# EAGLE design stm8-accelerometer -1 (EAGLE 6.5.0)
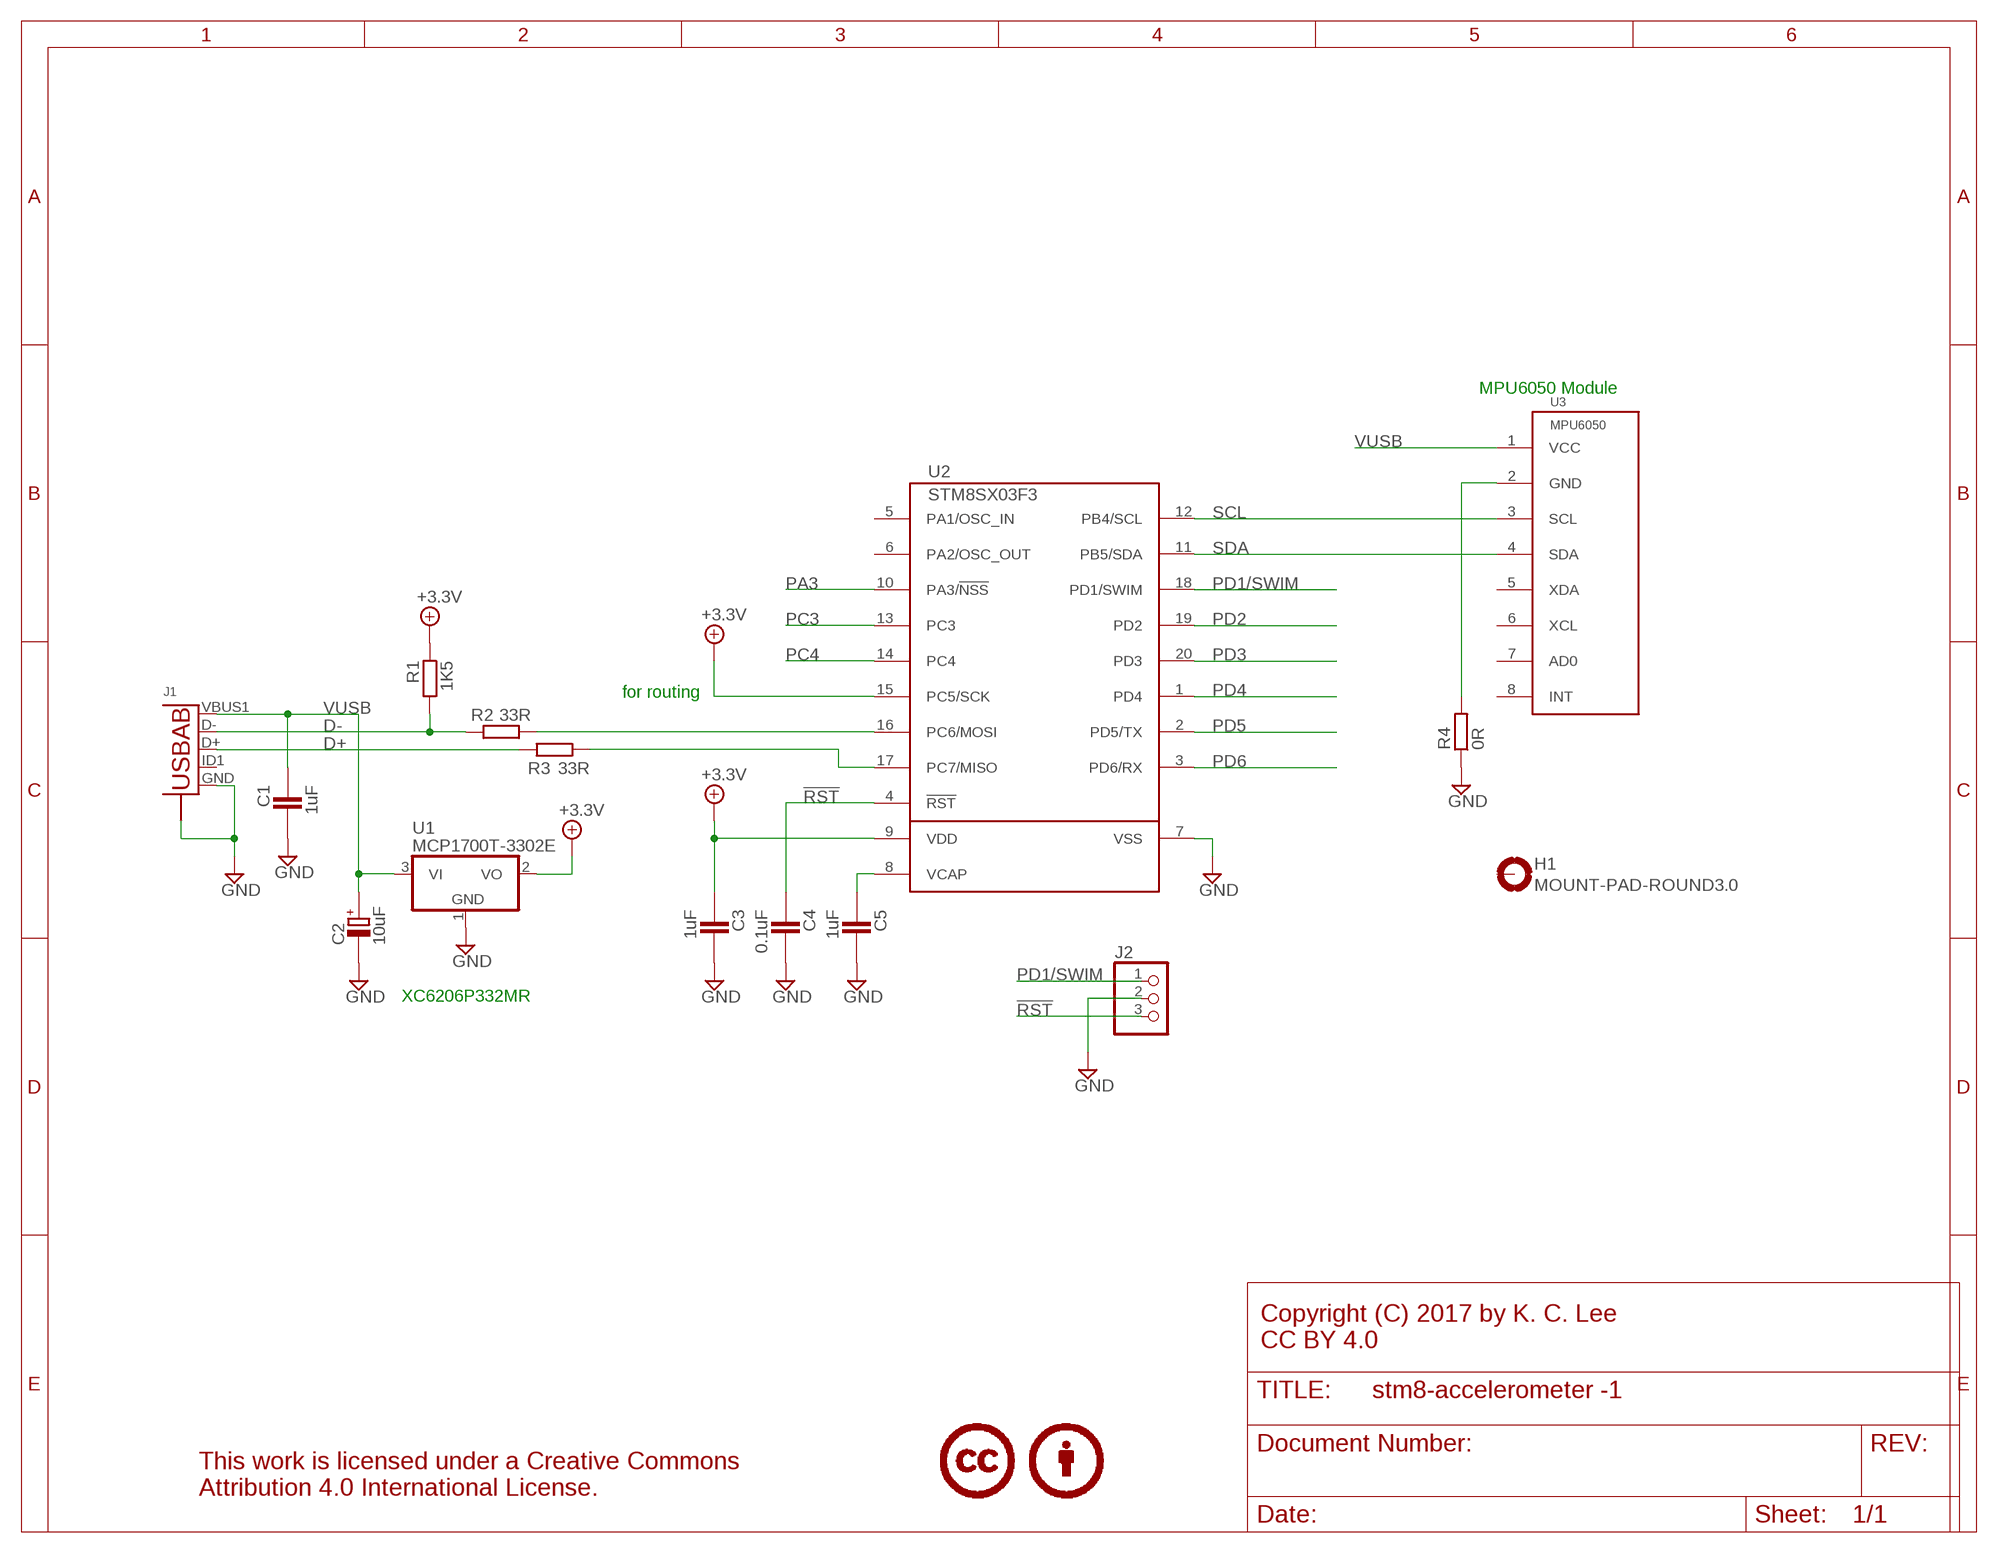
[diagram p0: schematic, sheet 1]

## Parts
C1  1uF  CAPACITOR_0603  [CAPC1608X92N]
C2  10uF  POLARISED_C_CASE  [CAPMP6032X280N]
C3  1uF  CAPACITOR_0603  [CAPC1608X92N]
C4  0.1uF  CAPACITOR_0603  [CAPC1608X92N]
C5  1uF  CAPACITOR_0603  [CAPC1608X92N]
H1  MOUNT-PAD-ROUND3.0  [3,0-PAD]
J1  USB-ABBG-ORG  [USB-AB-MICRO-SMD_V03_SMT]
J2  PINHD-1X3_2.54  [1X03]
LICENSE1  CC-BY50%  [CC-BY-50]
R1  1K5  RESISTOR_0603  [RESC1608X55N]
R2  33R  RESISTOR_0603  [RESC1608X55N]
R3  33R  RESISTOR_0603  [RESC1608X55N]
R4  0R  RESISTOR_1206  [RESC3115X70N]
U1  MCP1700T-3302E  MCP1700/TT  [SOT95P280X135-3N]
U2  STM8SX03F3  [TSSOP20]
U3  MPU6050  [MPU6050]

## Nets
!RST: C4.1 J2.3 U2.4(!RST)
+3.3V: C3.1 R1.1 U1.2(VO) U2.9(VDD) U2.15(PC5/SCK)
D+: J1.D+ R3.1
D-: J1.D- R1.2 R2.1
GND: C1.2 C2.- C3.2 C4.2 C5.2 J1.GND J1.S1(S) J1.S2(S) J1.S3(S) J1.S4(S) J2.2 R4.1 U1.1(GND) U2.7(VSS)
N$1: R4.2 U3.2(GND)
N$2: C5.1 U2.8(VCAP)
N$3: R3.2 U2.17(PC7/MISO)
N$4: R2.2 U2.16(PC6/MOSI)
PA3: U2.10(PA3/!NSS)
PC3: U2.13(PC3)
PC4: U2.14(PC4)
PD1/SWIM: J2.1 U2.18(PD1/SWIM)
PD2: U2.19(PD2)
PD3: U2.20(PD3)
PD4: U2.1(PD4)
PD5: U2.2(PD5/TX)
PD6: U2.3(PD6/RX)
SCL: U2.12(PB4/SCL) U3.3(SCL)
SDA: U2.11(PB5/SDA) U3.4(SDA)
VUSB: C1.1 C2.+ J1.VBUS1(VBUS) U1.3(VI) U3.1(VCC)
Unconnected: H1.B3,0(MOUNT) J1.ID1(USBID) U2.5(PA1/OSC_IN) U2.6(PA2/OSC_OUT) U3.5(XDA) U3.6(XCL) U3.7(AD0) U3.8(INT)

## Notes on the sheet
- MPU6050 Module
- for routing
- XC6206P332MR
- Copyright (C) 2017 by K. C. Lee
  CC BY 4.0

## Library data of the parts
C1 = ipc-7351-capacitor:CAPACITOR_; PARTNO: NC 0805
C2 = ipc-7351-capacitor:POLARISED_; PARTNO: 1uF X7R 0603
C3-C5 = ipc-7351-capacitor:CAPACITOR_; PARTNO: 1uF X7R 0603
H1 = holes:MOUNT-PAD-ROUND: MOUNTING PAD, round
J1 = Misc Conn:USB-AB: This is a USB AB connector that is compatible with USB OTG. i.e. this connector can serve as a host or device
J2 = pinhead-1:PINHD-1X3: PIN HEADER
LICENSE1 = Misc logo:CC-BY
R1 = ipc-7351-resistor:RESISTOR_; PARTNO: 1K5 0603
R2 R3 = ipc-7351-resistor:RESISTOR_; PARTNO: 47R 0603
R4 = ipc-7351-resistor:RESISTOR_
U1 = Misc Power:MCP1700; PARTNO: MCP1700T-3302E/TT
U2 = Misc Processor:STM8SX03F
U3 = misc pcb:MPU6050: MPU6050 Module

## Board
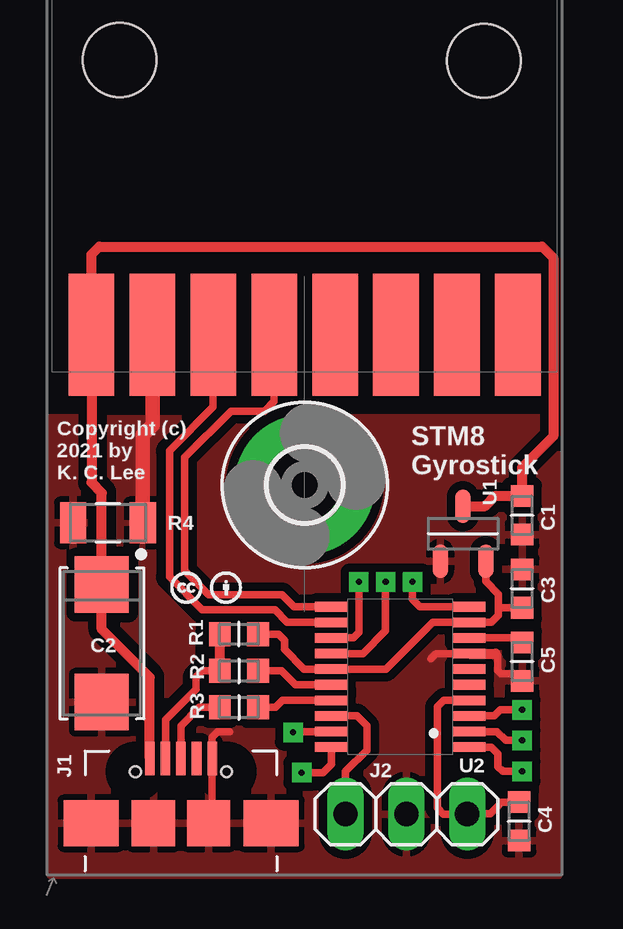
[diagram p1: board, top side]

No outline drawn. Coordinates in mm, seen from the top.
Copper layers (1*16): Top 0.035mm / dielectric 1.5mm / Bottom 0.035mm
Design rules "default *": minimum track width 10mil, minimum drill 24mil, track to track 8mil, track to pad 8mil, pad to pad 8mil, via to via 8mil, smd to smd 8mil, copper to edge 40mil, drill to drill 10mil, minimum pad ring 10mil, minimum via ring 8mil, stop-mask expansion 4mil, vias tented up to drill 0mil, thermal gap 10mil

### Footprints (pad centres in the part's own frame; a part is rotated, then mirrored left to right if it is on the bottom)
CAPC1608X92N = smd 0.9 x 0.95: 1 -0.8,0; 2 0.8,0
CAPMP6032X280N = smd 2.35 x 2.25: + -2.45,0; - 2.45,0
3,0-PAD = drill 3 pad 5.842: B3,0 0,0
USB-AB-MICRO-SMD_V03_SMT = smd 1.4 x 0.4: D+ 2.7,0; D- 2.7,0.65; GND 2.7,-1.3; ID1 2.7,-0.65; VBUS1 2.7,1.3 | smd 1.9 x 2.3: S1 0,3.75; S4 0,-3.75 | smd 1.9 x 1.8: S2 0,1.15; S3 0,-1.15 | hole 0.45: 2.15,1.9; 2.15,-1.9
1X03 = drill 1.016 long: 1 -2.54,0; 2 0,0; 3 2.54,0
RESC1608X55N = smd 0.9 x 1: 1 -0.8,0; 2 0.8,0
RESC3115X70N = smd 1.1 x 1.7: 1 -1.45,0; 2 1.45,0
SOT95P280X135-3N = smd 1.4 x 0.65: 1 -1.15,0.95; 2 -1.15,-0.95; 3 1.15,0
TSSOP20 = smd 0.4 x 1.35: 1 -2.925,-2.875; 2 -2.275,-2.875; 3 -1.625,-2.875; 4 -0.975,-2.875; 5 -0.325,-2.875; 6 0.325,-2.875; 7 0.975,-2.875; 8 1.625,-2.875; 9 2.275,-2.875; 10 2.925,-2.875; 11 2.925,2.875; 12 2.275,2.875; 13 1.625,2.875; 14 0.975,2.875; 15 0.325,2.875; 16 -0.325,2.875; 17 -0.975,2.875; 18 -1.625,2.875; 19 -2.275,2.875; 20 -2.925,2.875
MPU6050 = smd 5.08 x 1.905: 1 0,8.89; 2 0,6.35; 3 0,3.81; 4 0,1.27; 5 0,-1.27; 6 0,-3.81; 7 0,-6.35; 8 0,-8.89 | hole 3.073: 11.455,7.722; 11.43,-7.468

### Placement (x,y rotation side)
C1  19.81,14.99 270 top
C2  2.29,9.65 270 top
C3  19.81,11.94 90 top
C4  19.68,2.24 270 top
C5  19.81,8.89 270 top
H1  10.74,16.26 0 top
J1  5.59,2.16 90 top
J2  14.99,2.54 0 top
LICENSE1  5.13,11.28 0 top
R1  8,10.03 180 top
R2  8,8.51 0 top
R3  8,6.99 0 top
R4  2.54,14.68 0 top
U1  17.35,14.22 90 top
U2  14.73,8.26 90 top
U3  10.74,22.5 90 top

### Tracks (layer width: path | path; a pad name or v marks a point on that pad's centre or on a via)
!RST
  Top 0.305: U2.4 16.55,7.28 16.28,7.01 16.28,2.79 16.54,2.54 J2.3 17.54,2.55 18.48,2.55 18.76,2.83 18.95,3.02 18.96,3.04 C4.1
+3.3V
  Top 0.305: 8.76,10.07 R1.1 9.65,10.03 9.91,9.78 9.91,9.4 10.72,8.58 U2.15 14.14,8.58 15.91,10.35 16.09,10.53 U2.9 18.53,10.53 18.82,10.82 18.82,11.02 | U1.2 18.3,12.23 18.82,11.71 18.82,11.02 | C3.1 18.94,11.14 18.82,11.02
D+
  Top 0.305: J1.D+ 5.59,6.22 6.35,6.99 R3.1
D-
  Top 0.305: R2.1 6.48,8.51 6.22,8.26 6.22,7.75 4.94,6.46 J1.D-
  Top 0.406: R1.2 R2.1
GND
  Top 0.305: 6.25,2.31 J1.S3 | 18.71,9.23 18.8,9.14 18.8,8.51 18.92,8.38 19.81,8.38 | 6.89,2.18 J1.GND 6.89,5.75 7.11,5.97 7.62,5.97 | U2.7 16.21,9.23 16,9.02
  Top 0.406: 6.89,2.18 J1.S3 | U2.7 18.71,9.23
  pour Top (isolate 0.356): 21.34,19.05 21.34,0 0.13,0 0.13,19.05
N$1
  Top 0.61: U3.2 4.39,18.75 3.99,18.34 R4.2
  pour Top (isolate 0.406): 2.54,19.05 2.46,7.32 6.07,7.29 6.12,19.05 5.36,19.02 2.57,19.02
N$2
  Top 0.305: U2.8 19.75,9.88 C5.1
N$3
  Top 0.305: R3.2 9.53,6.99 9.82,7.28 U2.17
N$4
  Top 0.305: R2.2 9.78,8.51 10.36,7.93 U2.16
PA3  (via drill 0.25 pad 0.81)
  Top 0.305: U2.10 15.54,11.18 15.24,11.48 v15.24,12.22
PC3  (via drill 0.25 pad 0.81)
  Top 0.305: U2.13 12.78,9.88 13.01,10.11 v13.01,12.22
PC4  (via drill 0.25 pad 0.81)
  Top 0.305: U2.14 13.17,9.23 14.12,10.19 v14.12,12.22
PD1/SWIM
  Top 0.305: U2.18 12.93,6.63 13.34,6.22 13.34,5.21 12.45,4.32 J2.1
PD2  (via drill 0.25 pad 0.81)
  Top 0.305: U2.19 10.3,5.98 v10.26,5.94
PD3  (via drill 0.25 pad 0.81)
  Top 0.305: U2.20 11.86,4.62 11.51,4.27 v10.62,4.27
PD4  (via drill 0.25 pad 0.81)
  Top 0.305: U2.1 18.52,5.33 18.8,5.05 18.8,4.52 19,4.32 v19.81,4.32
PD5  (via drill 0.25 pad 0.81)
  Top 0.305: U2.2 18.76,5.98 19.13,5.61 v19.81,5.61
PD6  (via drill 0.25 pad 0.81)
  Top 0.305: U2.3 18.64,6.63 18.9,6.88 v19.81,6.88
SCL
  Top 0.305: U2.12 10.02,10.53 9.5,11.05 6.48,11.05 5.11,12.42 5.11,17.68 6.93,19.51 U3.3
SDA
  Top 0.305: U2.11 10.31,11.18 9.8,11.68 6.73,11.68 5.74,12.68 5.74,17.4 7.67,19.33 9.07,19.33 9.47,19.74 U3.4
VUSB
  Top 0.406: U1.3 18.27,15.37 18.68,15.79 C1.1 19.81,16.98 21.11,18.28 21.11,25.73 20.65,26.19 2.18,26.19 1.85,25.86 U3.1 1.85,16.36 2.29,15.93 C2.+ 2.29,10.24 4.29,8.23 J1.VBUS1

### Text on the board
tPlace: STM8 / Gyrostick | Copyright (c) / 2021 by / K. C. Lee
tDocu: MPU6050 dimensions are / measured on 1 sample / and should not be trusted.